# Altium schematic sheet Sheet1.SchDoc
size A3
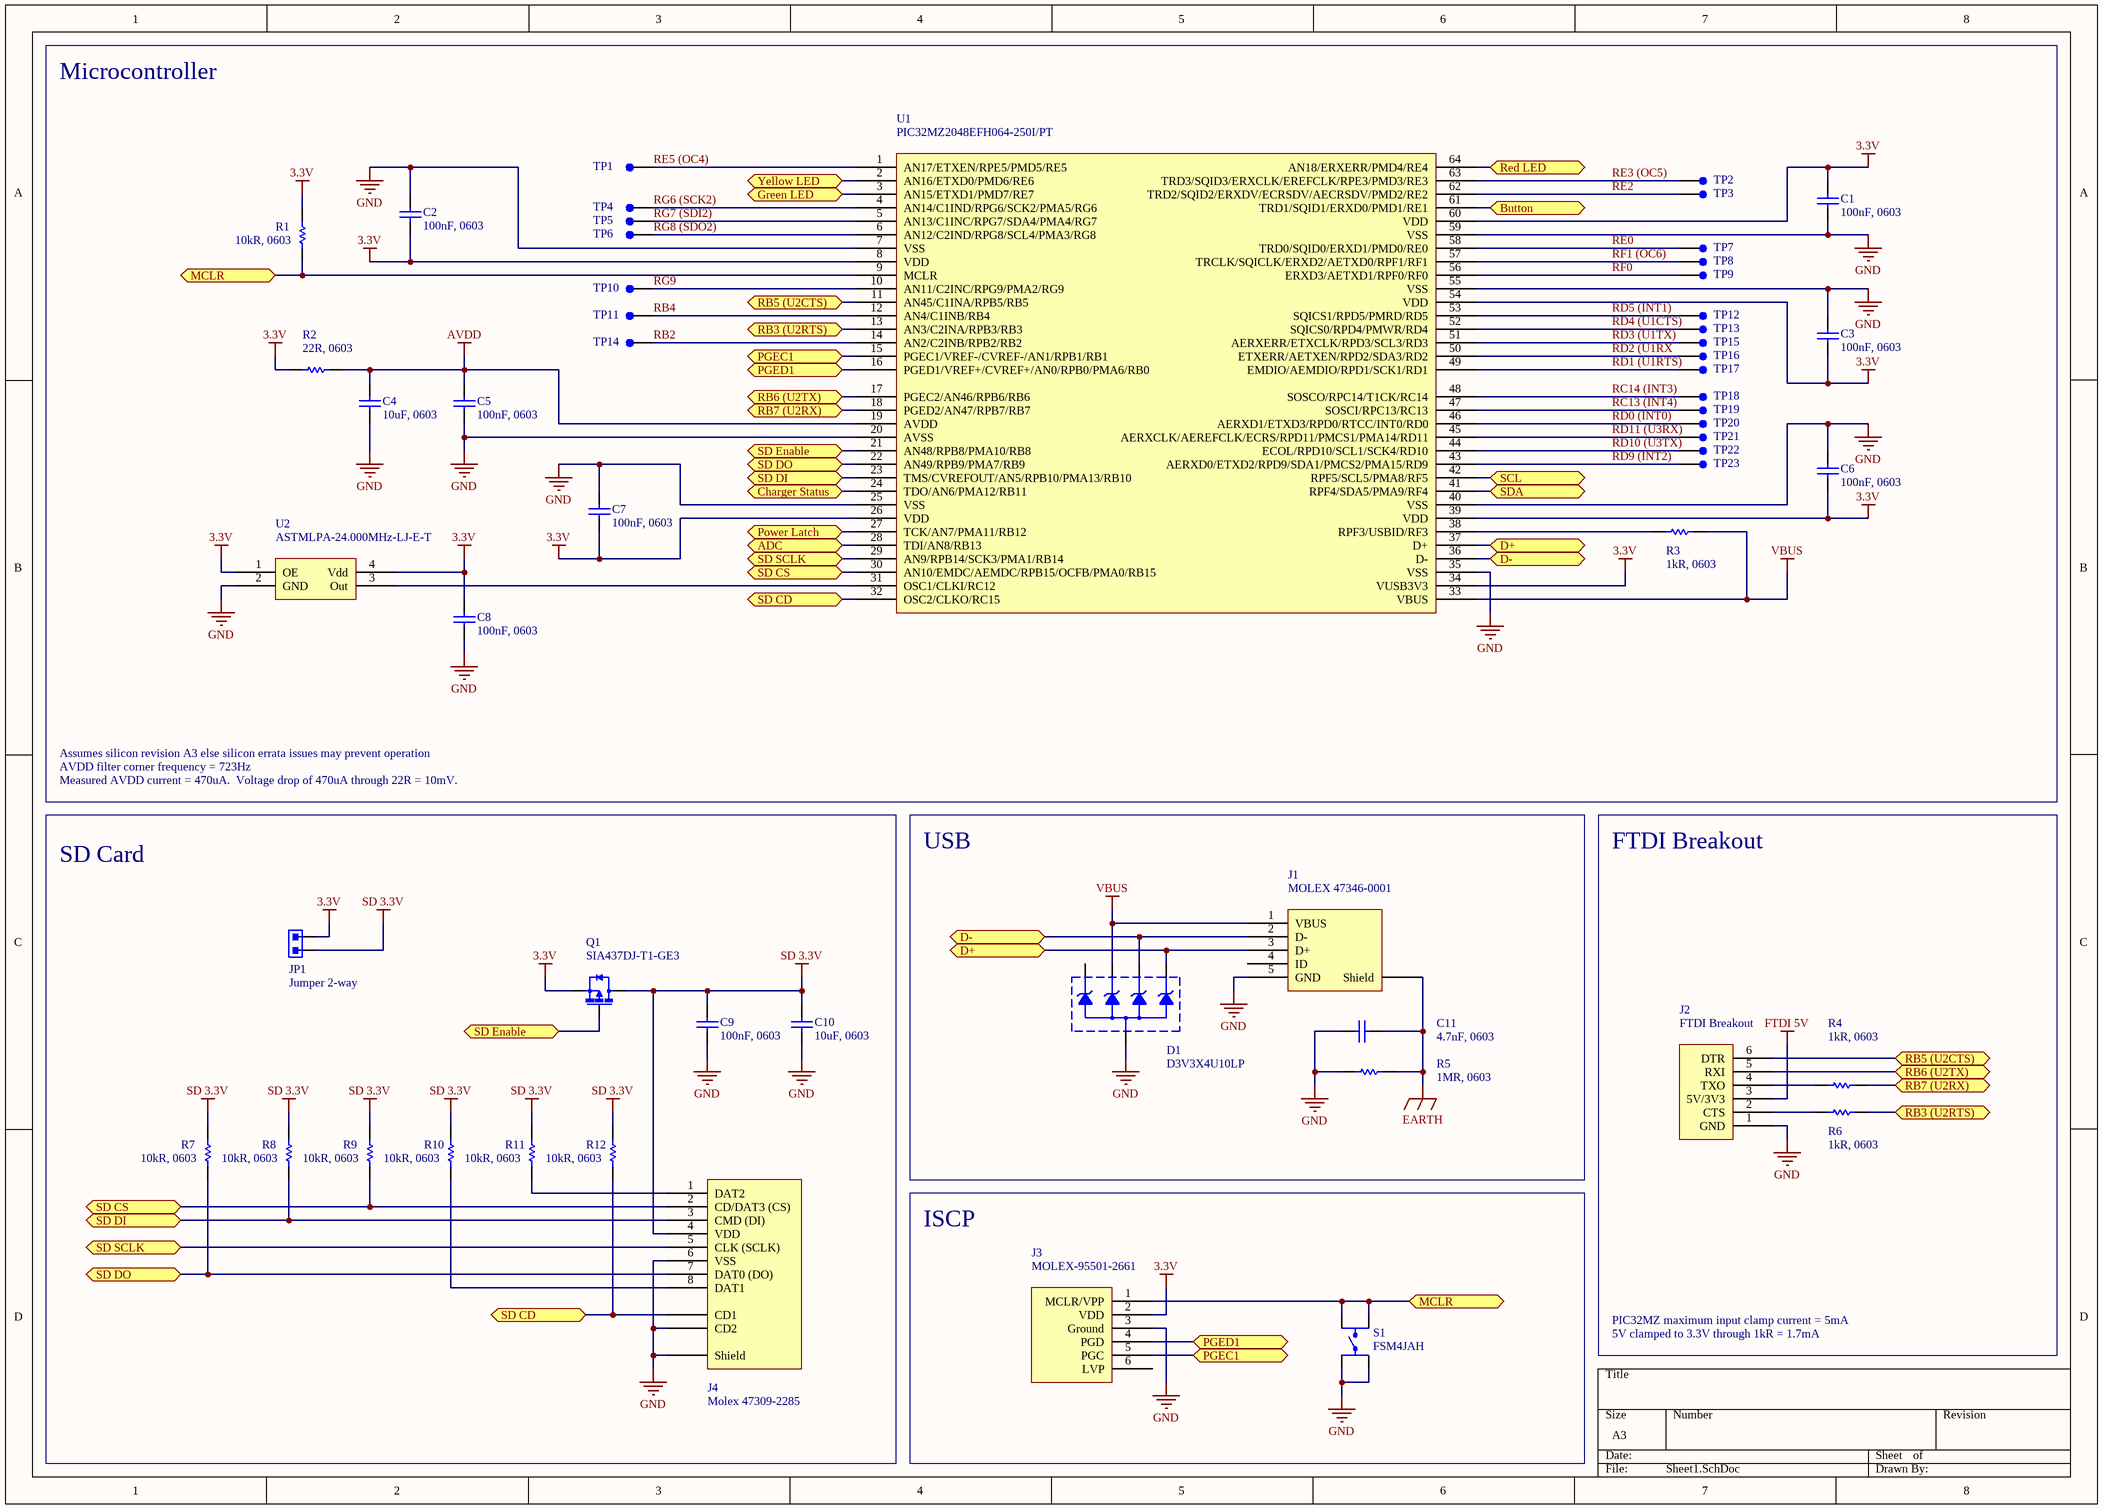
[diagram p0: Sheet1.SchDoc]

## Parts
C1  100nF, 0603  [Capacitor 0603]
C2  100nF, 0603  [Capacitor 0603]
C3  100nF, 0603  [Capacitor 0603]
C4  10uF, 0603  [Capacitor 0603]
C5  100nF, 0603  [Capacitor 0603]
C6  100nF, 0603  [Capacitor 0603]
C7  100nF, 0603  [Capacitor 0603]
C8  100nF, 0603  [Capacitor 0603]
C9  100nF, 0603  [Capacitor 0603]
C10  10uF, 0603  [Capacitor 0603]
C11  4.7nF, 0603  [Capacitor 0603]
D1  D3V3X4U10LP  [D3V3X4U10LP]
J1  MOLEX 47346-0001  [Molex 47346-0001]
J2  FTDI Breakout  [FTDI Breakout]
J3  MOLEX-95501-2661  [MOLEX-95501-2661]
J4  Molex 47309-2285  [Molex 47309-2285]
JP1  Jumper 2-way  [Jumper 2-way]
Q1  SIA437DJ-T1-GE3  [SIA437DJ-T1-GE3]
R1  10kR, 0603  [Resistor 0603]
R2  22R, 0603  [Resistor 0603]
R3  1kR, 0603  [Resistor 0603]
R4  1kR, 0603  [Resistor 0603]
R5  1MR, 0603  [Resistor 0603]
R6  1kR, 0603  [Resistor 0603]
R7  10kR, 0603  [Resistor 0603]
R8  10kR, 0603  [Resistor 0603]
R9  10kR, 0603  [Resistor 0603]
R10  10kR, 0603  [Resistor 0603]
R11  10kR, 0603  [Resistor 0603]
R12  10kR, 0603  [Resistor 0603]
S1  FSM4JAH  [FSM4JHX]
TP1  Test Point  [Test Point 1.5mm]  (value not drawn)
TP2  Test Point  [Test Point 1.5mm]  (value not drawn)
TP3  Test Point  [Test Point 1.5mm]  (value not drawn)
TP4  Test Point  [Test Point 1.5mm]  (value not drawn)
TP5  Test Point  [Test Point 1.5mm]  (value not drawn)
TP6  Test Point  [Test Point 1.5mm]  (value not drawn)
TP7  Test Point  [Test Point 1.5mm]  (value not drawn)
TP8  Test Point  [Test Point 1.5mm]  (value not drawn)
TP9  Test Point  [Test Point 1.5mm]  (value not drawn)
TP10  Test Point  [Test Point 1.5mm]  (value not drawn)
TP11  Test Point  [Test Point 1.5mm]  (value not drawn)
TP12  Test Point  [Test Point 1.5mm]  (value not drawn)
TP13  Test Point  [Test Point 1.5mm]  (value not drawn)
TP14  Test Point  [Test Point 1.5mm]  (value not drawn)
TP15  Test Point  [Test Point 1.5mm]  (value not drawn)
TP16  Test Point  [Test Point 1.5mm]  (value not drawn)
TP17  Test Point  [Test Point 1.5mm]  (value not drawn)
TP18  Test Point  [Test Point 1.5mm]  (value not drawn)
TP19  Test Point  [Test Point 1.5mm]  (value not drawn)
TP20  Test Point  [Test Point 1.5mm]  (value not drawn)
TP21  Test Point  [Test Point 1.5mm]  (value not drawn)
TP22  Test Point  [Test Point 1.5mm]  (value not drawn)
TP23  Test Point  [Test Point 1.5mm]  (value not drawn)
U1  PIC32MZ2048EFH064-250I/PT  [TQFP-64]
U2  ASTMLPA-24.000MHz-LJ-E-T  [ASTMLPA]

## Blocks framed on the sheet
Microcontroller: C1-C8 R1-R3 TP1-TP23 U1 U2
SD Card: C9 C10 J4 JP1 Q1 R7-R12
USB: C11 D1 J1 R5
FTDI Breakout: J2 R4 R6
ISCP: J3 S1

## Ports
ADC, Button, Charger Status, D+, D-, Green LED, MCLR, PGEC1, PGED1, Power Latch, RB3 (U2RTS), RB5 (U2CTS), RB6 (U2TX), RB7 (U2RX), Red LED, SCL, SD CD, SD CS, SD DI, SD DO, SD Enable, SD SCLK, SDA, Yellow LED

## Nets
3.3V: C1.1 C2.1 C3.2 C6.2 C7.1 C8.2 J3.2(VDD) JP1.1 Q1.S R1.2 R2.2 U1.8(VDD) U1.26(VDD) U1.34(VUSB3V3) U1.39(VDD) U1.54(VDD) U1.60(VDD) U2.1(OE) U2.4(Vdd)
AVDD: C4.2 C5.2 R2.1 U1.19(AVDD)
EARTH: C11.2 J1.Shield R5.2
FTDI 5V: J2.3(5V/3V3)
GND: C1.2 C2.2 C3.1 C4.1 C5.1 C6.1 C7.2 C8.1 C9.1 C10.1 C11.1 D1.A J1.5(GND) J2.1(GND) J3.3(Ground) J4.6(VSS) J4.CD2 J4.Shield R5.1 S1.1 S1.2 U1.7(VSS) U1.20(AVSS) U1.25(VSS) U1.35(VSS) U1.40(VSS) U1.55(VSS) U1.59(VSS) U2.2(GND)
SD 3.3V: C9.2 C10.2 J4.4(VDD) JP1.2 Q1.D R7.2 R8.2 R9.2 R10.2 R11.2 R12.2
VBUS: D1.K2 J1.1(VBUS) R3.1 U1.33(VBUS)
ADC: U1.28(TDI/AN8/RB13) ; port ADC
Button: U1.61(TRD1/SQID1/ERXD0/PMD1/RE1) ; port Button
Charger Status: U1.24(TDO/AN6/PMA12/RB11) ; port Charger Status
D+: D1.K4 J1.3(D+) U1.37(D+) ; port D+
D-: D1.K3 J1.2(D-) U1.36(D-) ; port D-
Green LED: U1.3(AN15/ETXD1/PMD7/RE7) ; port Green LED
MCLR: J3.1(MCLR/VPP) R1.1 S1.3 S1.4 U1.9(MCLR) ; port MCLR
PGEC1: J3.5(PGC) U1.15(PGEC1/VREF-/CVREF-/AN1/RPB1/RB1) ; port PGEC1
PGED1: J3.4(PGD) U1.16(PGED1/VREF+/CVREF+/AN0/RPB0/PMA6/RB0) ; port PGED1
Power Latch: U1.27(TCK/AN7/PMA11/RB12) ; port Power Latch
RB2: TP14.1 U1.14(AN2/C2INB/RPB2/RB2)
RB3 (U2RTS): R6.1 U1.13(AN3/C2INA/RPB3/RB3) ; port RB3 (U2RTS)
RB4: TP11.1 U1.12(AN4/C1INB/RB4)
RB5 (U2CTS): J2.6(DTR) U1.11(AN45/C1INA/RPB5/RB5) ; port RB5 (U2CTS)
RB6 (U2TX): J2.5(RXI) U1.17(PGEC2/AN46/RPB6/RB6) ; port RB6 (U2TX)
RB7 (U2RX): R4.1 U1.18(PGED2/AN47/RPB7/RB7) ; port RB7 (U2RX)
RC13 (INT4): TP19.1 U1.47(SOSCI/RPC13/RC13)
RC14 (INT3): TP18.1 U1.48(SOSCO/RPC14/T1CK/RC14)
RD0 (INT0): TP20.1 U1.46(AERXD1/ETXD3/RPD0/RTCC/INT0/RD0)
RD1 (U1RTS): TP17.1 U1.49(EMDIO/AEMDIO/RPD1/SCK1/RD1)
RD2 (U1RX: TP16.1 U1.50(ETXERR/AETXEN/RPD2/SDA3/RD2)
RD3 (U1TX): TP15.1 U1.51(AERXERR/ETXCLK/RPD3/SCL3/RD3)
RD4 (U1CTS): TP13.1 U1.52(SQICS0/RPD4/PMWR/RD4)
RD5 (INT1): TP12.1 U1.53(SQICS1/RPD5/PMRD/RD5)
RD9 (INT2): TP23.1 U1.43(AERXD0/ETXD2/RPD9/SDA1/PMCS2/PMA15/RD9)
RD10 (U3TX): TP22.1 U1.44(ECOL/RPD10/SCL1/SCK4/RD10)
RD11 (U3RX): TP21.1 U1.45(AERXCLK/AEREFCLK/ECRS/RPD11/PMCS1/PMA14/RD11)
RE0: TP7.1 U1.58(TRD0/SQID0/ERXD1/PMD0/RE0)
RE2: TP3.1 U1.62(TRD2/SQID2/ERXDV/ECRSDV/AECRSDV/PMD2/RE2)
RE3 (OC5): TP2.1 U1.63(TRD3/SQID3/ERXCLK/EREFCLK/RPE3/PMD3/RE3)
RE5 (OC4): TP1.1 U1.1(AN17/ETXEN/RPE5/PMD5/RE5)
Red LED: U1.64(AN18/ERXERR/PMD4/RE4) ; port Red LED
RF0: TP9.1 U1.56(ERXD3/AETXD1/RPF0/RF0)
RF1 (OC6): TP8.1 U1.57(TRCLK/SQICLK/ERXD2/AETXD0/RPF1/RF1)
RG6 (SCK2): TP4.1 U1.4(AN14/C1IND/RPG6/SCK2/PMA5/RG6)
RG7 (SDI2): TP5.1 U1.5(AN13/C1INC/RPG7/SDA4/PMA4/RG7)
RG8 (SDO2): TP6.1 U1.6(AN12/C2IND/RPG8/SCL4/PMA3/RG8)
RG9: TP10.1 U1.10(AN11/C2INC/RPG9/PMA2/RG9)
SCL: U1.42(RPF5/SCL5/PMA8/RF5) ; port SCL
SD CD: J4.CD1 R12.1 U1.32(OSC2/CLKO/RC15) ; port SD CD
SD CS: J4.2(CD/DAT3_(CS)) R9.1 U1.30(AN10/EMDC/AEMDC/RPB15/OCFB/PMA0/RB15) ; port SD CS
SD DI: J4.3(CMD_(DI)) R8.1 U1.23(TMS/CVREFOUT/AN5/RPB10/PMA13/RB10) ; port SD DI
SD DO: J4.7(DAT0_(DO)) R7.1 U1.22(AN49/RPB9/PMA7/RB9) ; port SD DO
SD Enable: Q1.G U1.21(AN48/RPB8/PMA10/RB8) ; port SD Enable
SD SCLK: J4.5(CLK_(SCLK)) U1.29(AN9/RPB14/SCK3/PMA1/RB14) ; port SD SCLK
SDA: U1.41(RPF4/SDA5/PMA9/RF4) ; port SDA
Yellow LED: U1.2(AN16/ETXD0/PMD6/RE6) ; port Yellow LED
NetJ2_2: J2.2(CTS) R6.2
NetJ2_4: J2.4(TXO) R4.2
NetJ4_1: J4.1(DAT2) R11.1
NetJ4_8: J4.8(DAT1) R10.1
NetR3_2: R3.2 U1.38(RPF3/USBID/RF3)
NetU1_31: U1.31(OSC1/CLKI/RC12) U2.3(Out)

Not connected (* = marked no-connect by the designer): D1 K1; J1 4(ID); J3 6(LVP)

## Notes on the sheet
- Assumes silicon revision A3 else silicon errata issues may prevent operation
- AVDD filter corner frequency = 723Hz
- Measured AVDD current = 470uA.  Voltage drop of 470uA through 22R = 10mV.
- PIC32MZ maximum input clamp current = 5mA
- 5V clamped to 3.3V through 1kR = 1.7mA

## Library data of the parts
C1-C11 = Capacitor
J1 = USB Socket
J3 = MPLAB ICD 3
Q1 = MOSFET P-Channel
R1-R12 = Resistor
S1 = Tactile Switch
U1 = PIC32MZ2048EFH064